# Altium schematic sheet РЕУН.468323.001_LED_DRV_TEC.SchDoc: =Name-1str
size 594 x 420 mm; SheetNumber: 8; Вид изделия: Документация; Раздел: Документация; Код документа: Э3; Вид документа: Схема электрическая принципиальная; Класс документа: Конструкторский документ; Создавать изделие в PLM: Yes; DocumentCode: РЕУН.468323.001 Э3 2D; DocumentView: Схема электрическая принципиальная; DocumentClass: Конструкторский документ; ProductView: Документация; Format: А2
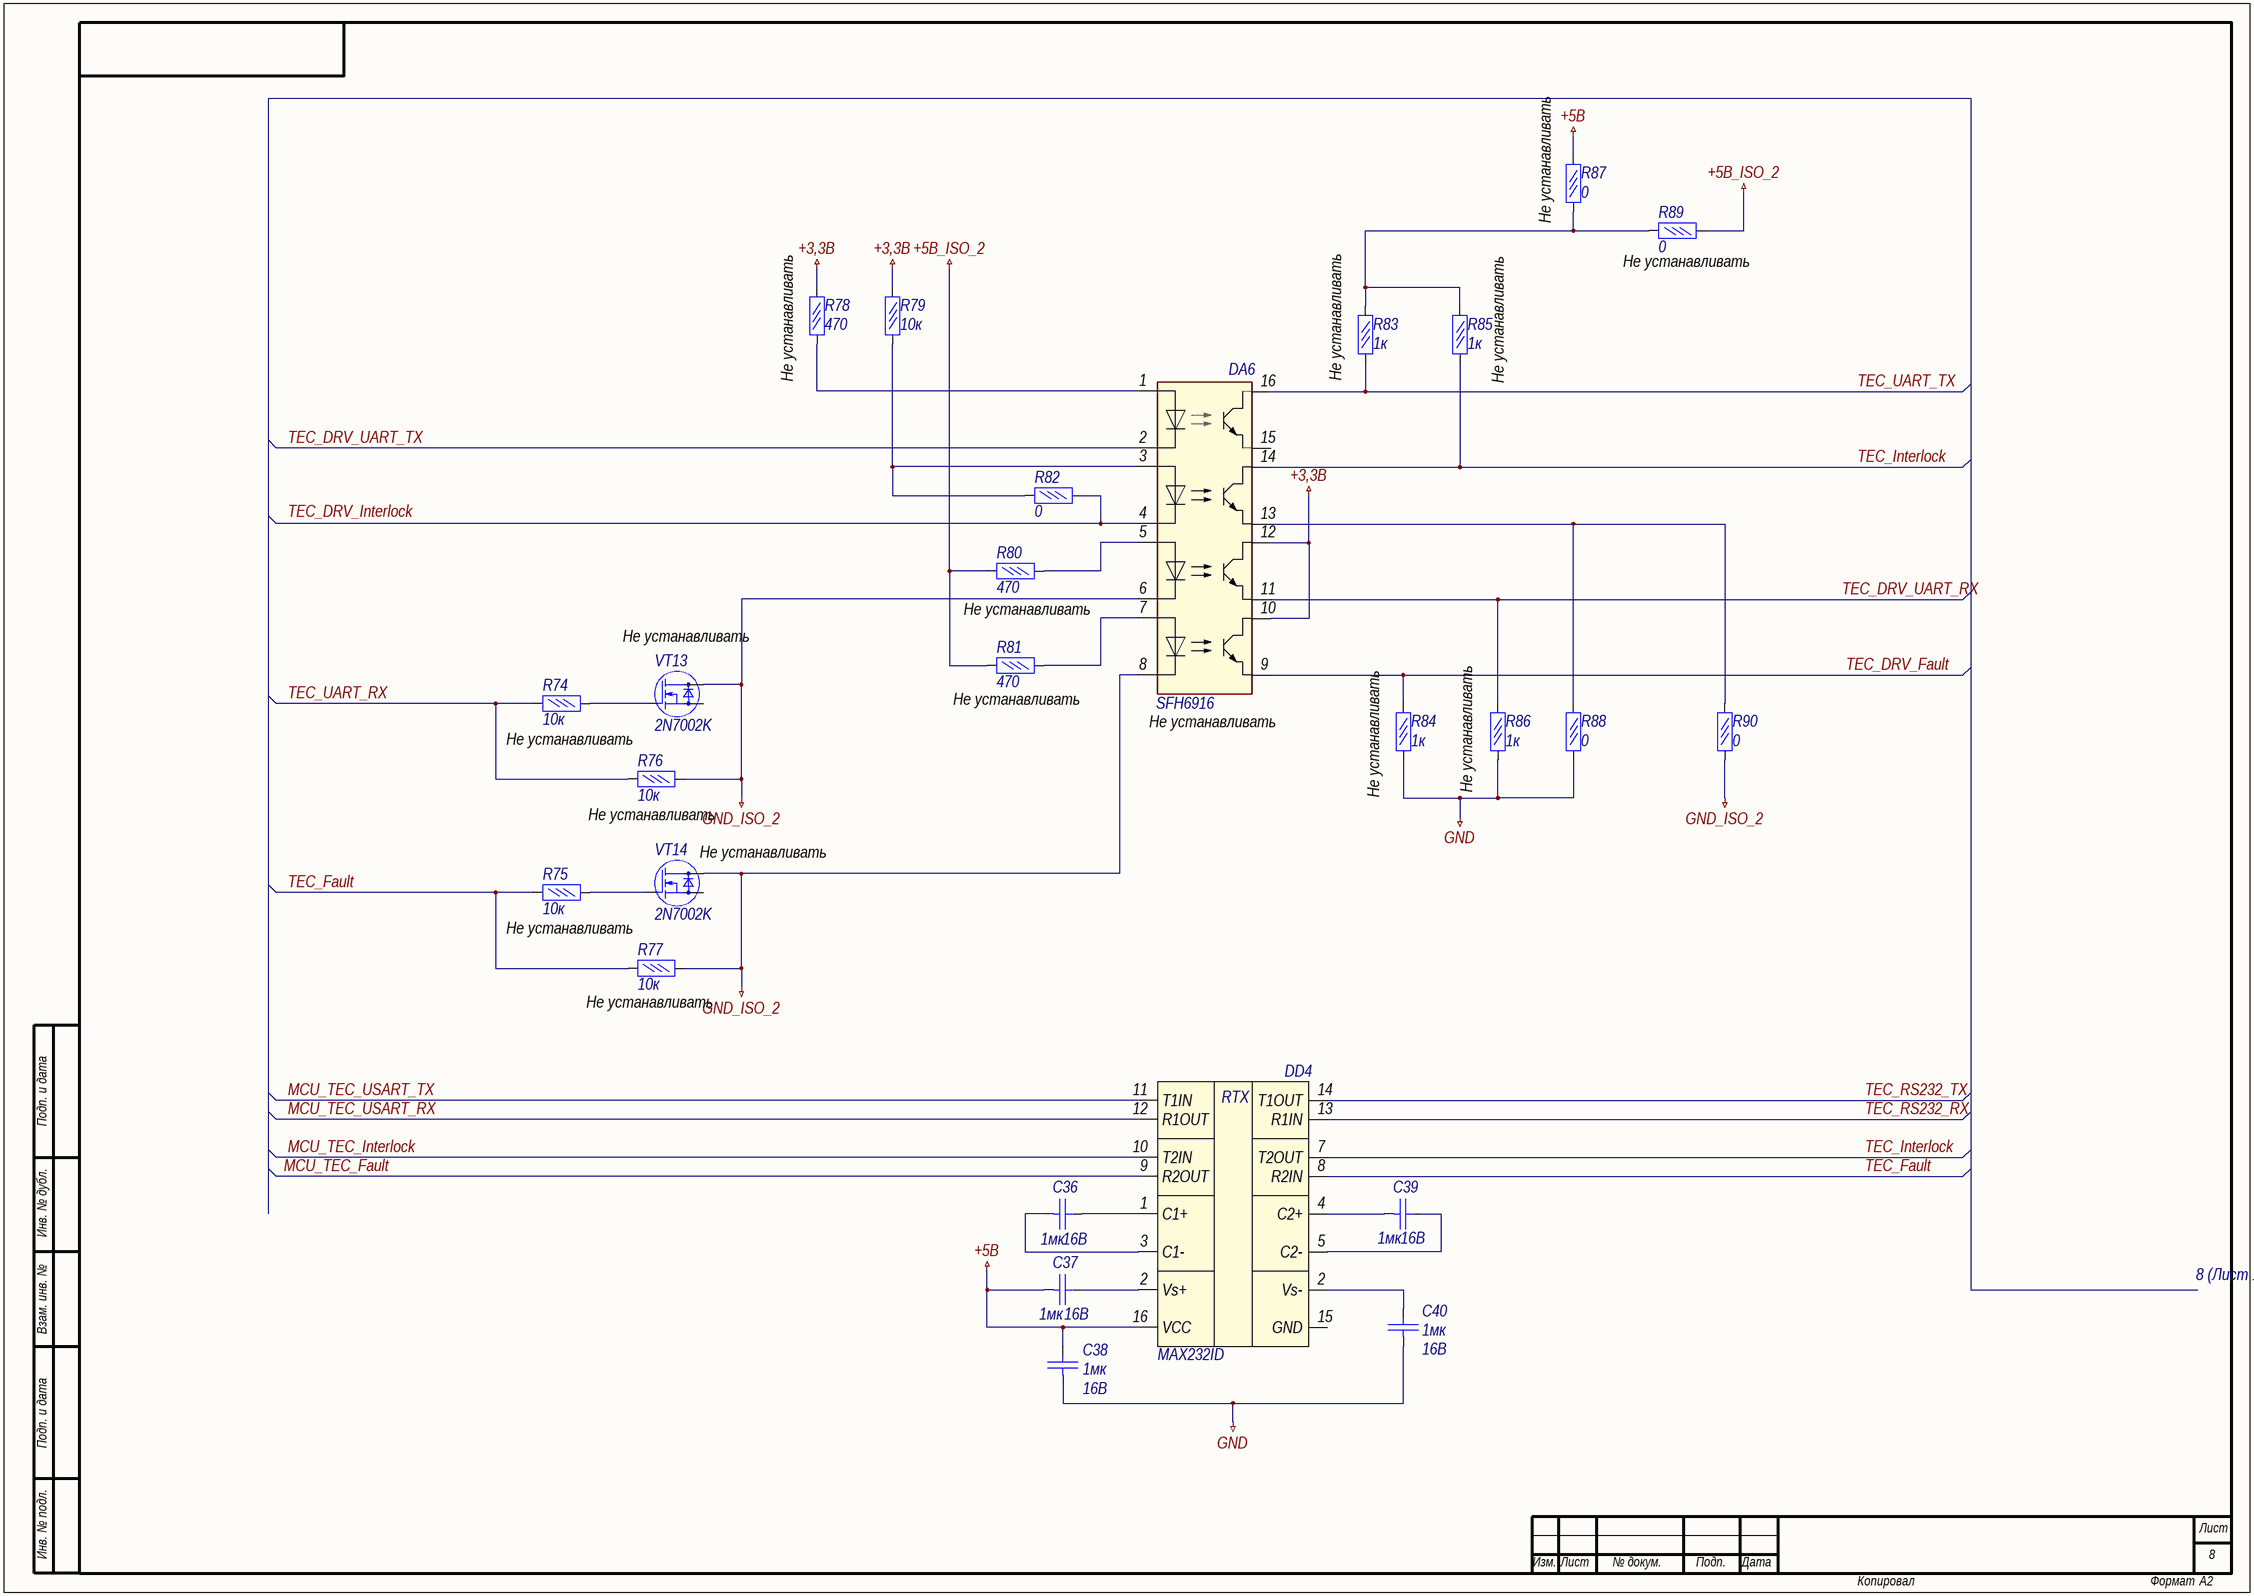
[diagram p0: РЕУН.468323.001_LED_DRV_TEC.SchDoc]

## Parts
C36  Voltage: 16В  [C0805_AA]  (hidden comment: 1мк)
C37  Voltage: 16В  [C0805_AA]  (hidden comment: 1мк)
C38  Voltage: 16В  [C0805_AA]  (hidden comment: 1мк)
C39  Voltage: 16В  [C0805_AA]  (hidden comment: 1мк)
C40  Voltage: 16В  [C0805_AA]  (hidden comment: 1мк)
DA6  SFH6916
DD4  MAX232ID
R74  10к  [R1206]
R75  10к  [R1206]
R76  10к  [R1206]
R77  10к  [R1206]
R78  470  [R1206]
R79  10к  [R1206]
R80  470  [R1206]
R81  470  [R1206]
R82  0  [R1206]
R83  1к  [R1206]
R84  1к  [R1206]
R85  1к  [R1206]
R86  1к  [R1206]
R87  0  [R1206]
R88  0  [R1206]
R89  0  [R1206]
R90  0  [R1206]
VT13  2N7002K  [SOT23-3]
VT14  2N7002K  [SOT23-3]

## Nets
+3,3В: DA6.10 DA6.12 R78.1 R79.2
+5В: C37.2 C38.1 DD4.16(VCC) R87.1
+5В_ISO_2: R80.1 R81.1 R89.1
GND: C38.2 C40.2 R84.1 R86.1 R88.1
GND_ISO_2: DA6.6 DA6.8 R76.2 R77.2 R90.1 VT13.3(D) VT14.3(D)
MCU_TEC_Fault: DD4.9(R2OUT)
MCU_TEC_Interlock: DD4.10(T2IN)
MCU_TEC_USART_RX: DD4.12(R1OUT)
MCU_TEC_USART_TX: DD4.11(T1IN)
TEC_DRV_Fault: DA6.9 R84.2
TEC_DRV_UART_RX: DA6.11 R86.2
TEC_DRV_UART_TX: DA6.2
TEC_Fault: DD4.8(R2IN) R75.1 R77.1
TEC_Interlock: DA6.14 DD4.7(T2OUT) R85.1
TEC_RS232_RX: DD4.13(R1IN)
TEC_RS232_TX: DD4.14(T1OUT)
TEC_UART_RX: R74.1 R76.1
TEC_UART_TX: DA6.16 R83.1
NetC36_1: C36.1 DD4.1(C1+)
NetC36_2: C36.2 DD4.3(C1-)
NetC37_1: C37.1 DD4.2(Vs+)
NetC39_1: C39.1 DD4.5(C2-)
NetC39_2: C39.2 DD4.4(C2+)
NetC40_1: C40.1 DD4.2(Vs-)
NetDA6_1: DA6.1 R78.2
NetDA6_3: DA6.3 R79.1 R82.1
NetDA6_4: DA6.4 R82.2
NetDA6_5: DA6.5 R80.2
NetDA6_7: DA6.7 R81.2
NetDA6_13: DA6.13 R88.2 R90.2
NetR74_2: R74.2 VT13.1(G)
NetR75_2: R75.2 VT14.1(G)
NetR83_2: R83.2 R85.2 R87.2 R89.2

Not connected (* = marked no-connect by the designer): DA6 15; DD4 15(GND); VT13 2(S); VT14 2(S)

## Notes on the sheet
- (near R87) Не устанавливать
- (near R89) Не устанавливать
- (near R78) Не устанавливать
- (near R83) Не устанавливать
- (near R85) Не устанавливать
- (near VT13) Не устанавливать
- Не устанавливать
- (near R81) Не устанавливать
- (near DA6) Не устанавливать
- (near R84) Не устанавливать
- (near R86) Не устанавливать
- (near R76) Не устанавливать
- (near VT14) Не устанавливать
- (near R77) Не устанавливать
- 8 (Лист 1, 3, 4, 5, 6, 7, 9, 10, 11, 12)
- Labels drawn without touching a wire or pin: TEC_DRV_Interlock
- Подп. и дата
- Инв. № дубл.
- Взам. инв. №
- Инв. № подл.
- Лист
- Изм.
- № докум.
- Подп.
- Дата
- Копировал
- Формат
- (in symbol MAX232ID) RTX

## Library data of the parts
C36-C40 = Конденсатор кер.: Name: CC0603KRX7R7BB105; Value: 1мк
DA6 = OPTO-4: Опторазвязка х4
DD4 = MAX232ID: Dual EIA-232 Drivers/Receivers
R74-R90 = Резистор  0,05Вт: Резистор 0,05Вт; Power rating: 0,05Вт
  R74-R77 R79: Value: 10к
  R78 R80 R81: Value: 470
  R82 R87-R90: Value: 0
  R83-R86: Value: 1к
VT13 VT14 = mosfet-n: Name: 2N7002K